# Altium schematic sheet IQ_Demodulator.SchDoc: =ProjectName
size 420 x 297 mm; Author: SBH; CompanyName: WUT; DrawnBy: SBH; Organization: ISE-WUT; Address1: Warsaw Univeristy of Technology; Address2: Nowowiejska 15/19; Revision: -; SheetNumber: -; SheetTotal: -; EDA_Number: ARTIQ; Projet: ADC/DAC MEZZANINE; ModifiedBy: -; CreateDate: XX/XX/XXXX; CheckedDate: -; Title2: IQ_Demodulator.SchDoc; DivGrp: ISE; Designer: SBH; ModifiedDate: -; ProjectName: ADC/DAC MEZZANINE
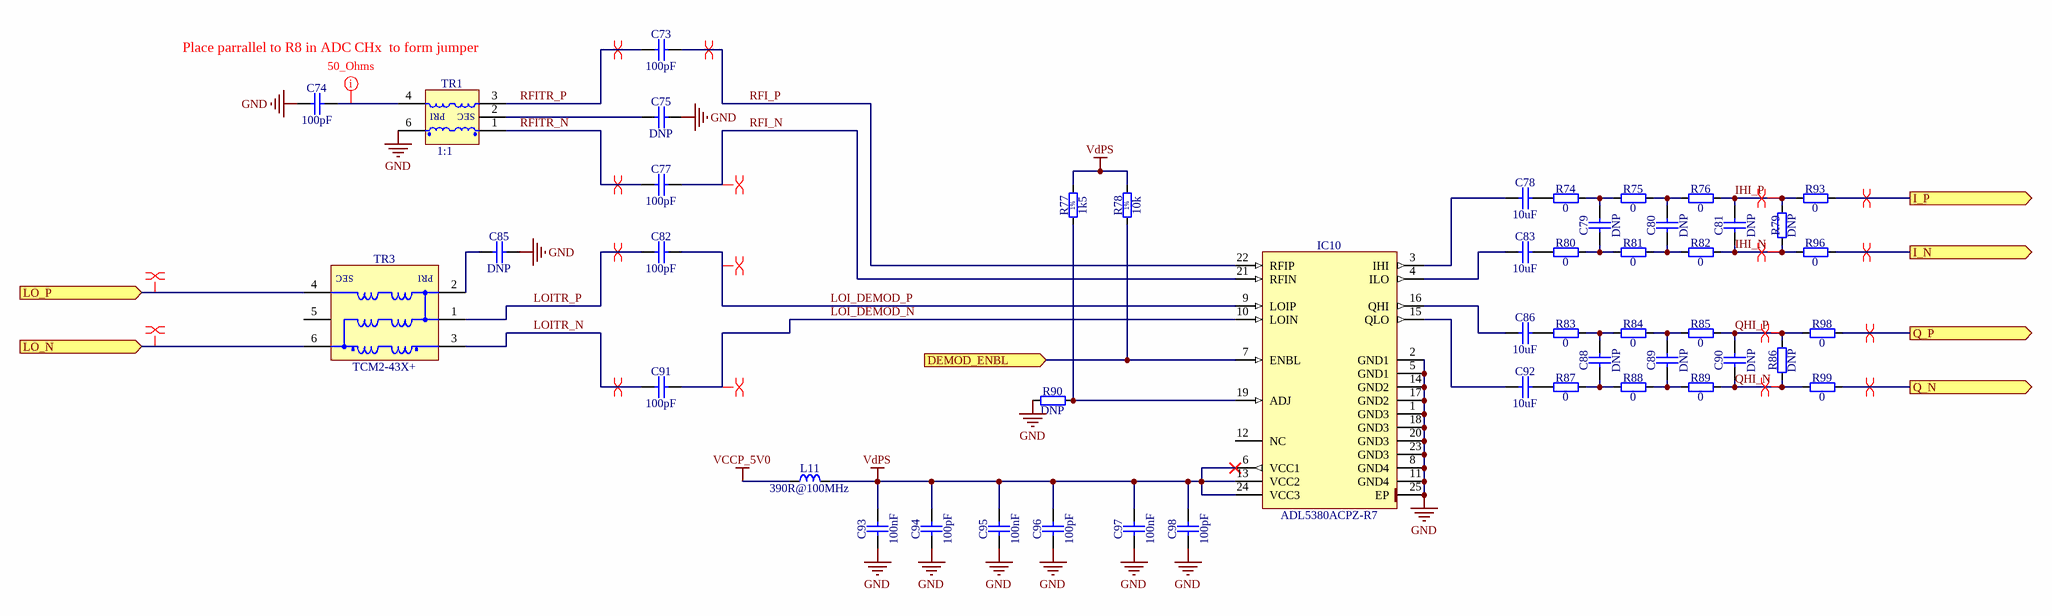
[diagram p0: IQ_Demodulator.SchDoc]

## Parts
C73  100pF  [CAPC1005X55N]
C74  100pF  [CAPC1005X55N]
C75  DNP  [CAPC1005X55N]
C77  100pF  [CAPC1005X55N]
C78  10uF  [CAPC1005X70N]
C79  DNP  [CAPC1005X55N]
C80  DNP  [CAPC1005X55N]
C81  DNP  [CAPC1005X55N]
C82  100pF  [CAPC1005X55N]
C83  10uF  [CAPC1005X70N]
C85  DNP  [CAPC1005X55N]
C86  10uF  [CAPC1005X70N]
C88  DNP  [CAPC1005X55N]
C89  DNP  [CAPC1005X55N]
C90  DNP  [CAPC1005X55N]
C91  100pF  [CAPC1005X55N]
C92  10uF  [CAPC1005X70N]
C93  100nF  [CAPC1005X55N]
C94  100pF  [CAPC1005X55N]
C95  100nF  [CAPC1005X55N]
C96  100pF  [CAPC1005X55N]
C97  100nF  [CAPC1005X55N]
C98  100pF  [CAPC1005X55N]
IC10  ADL5380ACPZ-R7  [QFN50P400X400X100-25N-S265]
L11  390R@100MHz  [INDC1608X95N]
R74  0  [RESC1005X40N]
R75  0  [RESC1005X40N]
R76  0  [RESC1005X40N]
R77  1k5  [RESC1005X40N]
R78  10k  [RESC1005X40N]
R79  DNP  [RESC1005X40N]
R80  0  [RESC1005X40N]
R81  0  [RESC1005X40N]
R82  0  [RESC1005X40N]
R83  0  [RESC1005X40N]
R84  0  [RESC1005X40N]
R85  0  [RESC1005X40N]
R86  DNP  [RESC1005X40N]
R87  0  [RESC1005X40N]
R88  0  [RESC1005X40N]
R89  0  [RESC1005X40N]
R90  DNP  [RESC1005X40N]
R93  0  [RESC1005X40N]
R96  0  [RESC1005X40N]
R98  0  [RESC1005X40N]
R99  0  [RESC1005X40N]
TR1  1:1  [XFMR_MINI-CIRCUITS_AT1521]
TR3  TCM2-43X+  [XFMR_MINI-CIRCUITS_DB1627]

## Ports
DEMOD_ENBL (in), I_N (out), I_P (out), LO_N (in), LO_P (in), Q_N (out), Q_P (out)

## Nets
GND: C74.1 C75.2 C85.2 C93.1 C94.1 C95.1 C96.1 C97.1 C98.1 IC10.1(GND3) IC10.2(GND1) IC10.5(GND1) IC10.8(GND4) IC10.11(GND4) IC10.14(GND2) IC10.17(GND2) IC10.18(GND3) IC10.20(GND3) IC10.23(GND3) IC10.25(EP) R90.1 TR1.6(PDOT)
VCCP_5V0: L11.1
VdPS: C93.2 C94.2 C95.2 C96.2 C97.2 C98.2 IC10.6(VCC1) IC10.13(VCC2) IC10.24(VCC3) L11.2 R77.2 R78.2
DEMOD_ENBL: IC10.7(ENBL) R78.1 ; port DEMOD_ENBL
I_N: R96.2 ; port I_N
I_P: R93.2 ; port I_P
IHI_N: C81.1 R79.1 R82.2 R96.1
IHI_P: C81.2 R76.2 R79.2 R93.1
LO_N: TR3.6(S1) ; port LO_N
LO_P: TR3.4(S1) ; port LO_P
LOI_DEMOD_N: C91.2 IC10.10(LOIN)
LOI_DEMOD_P: C82.2 IC10.9(LOIP)
LOITR_N: C91.1 TR3.3(P1)
LOITR_P: C82.1 TR3.1(P1)
Q_N: R99.2 ; port Q_N
Q_P: R98.2 ; port Q_P
QHI_N: C90.1 R86.1 R89.2 R99.1
QHI_P: C90.2 R85.2 R86.2 R98.1
RFI_N: C77.2 IC10.21(RFIN)
RFI_P: C73.2 IC10.22(RFIP)
RFITR_N: C77.1 TR1.1(SDOT)
RFITR_P: C73.1 TR1.3(S)
NetC74_2: C74.2 TR1.4(P)
NetC75_1: C75.1 TR1.2(NC)
NetC78_1: C78.1 IC10.3(IHI)
NetC78_2: C78.2 R74.1
NetC79_1: C79.1 R80.2 R81.1
NetC79_2: C79.2 R74.2 R75.1
NetC80_1: C80.1 R81.2 R82.1
NetC80_2: C80.2 R75.2 R76.1
NetC83_1: C83.1 IC10.4(ILO)
NetC83_2: C83.2 R80.1
NetC85_1: C85.1 TR3.2(P1)
NetC86_1: C86.1 IC10.16(QHI)
NetC86_2: C86.2 R83.1
NetC88_1: C88.1 R87.2 R88.1
NetC88_2: C88.2 R83.2 R84.1
NetC89_1: C89.1 R88.2 R89.1
NetC89_2: C89.2 R84.2 R85.1
NetC92_1: C92.1 IC10.15(QLO)
NetC92_2: C92.2 R87.1
NetIC10_19: IC10.19(ADJ) R77.1 R90.2

Not connected (* = marked no-connect by the designer): IC10 12(NC); TR3 5(NC)

## Layout directives
differential pair: I_N, I_P, IHI_N, IHI_P, LO_N, LO_P, LOI_DEMOD_N, LOI_DEMOD_P, LOITR_N, LOITR_P, Q_N, Q_P, QHI_N, QHI_P, RFI_N, RFI_P, RFITR_N, RFITR_P
net class 50_Ohms: NetC74_2

## Notes on the sheet
- Place parrallel to R8 in ADC CHx  to form jumper
- Project/Equipment
- Document
- Designer
- Drawn by
- Check.by
- File
- Last Mod.
- Print Date
- Sheet
- Size
- A3
- of
- Rev
- (in symbol R0402_1K5_1%_0.0625W_100PPM) 1%
- (in symbol R0402_10K_1%_0.0625W_100PPM) 1%
- (in symbol XFMR_MINI-CIRCUITS_TC1-1-43X+) PRI; SEC
- (in symbol XFMR_MINI-CIRCUITS_TCM2-43X+) SEC; PRI

## Library data of the parts
C73 C74 C77 C82 C91 C94 C96 C98 = CC0402_100PF_50V_5%_C0G: Non-polarised capacitor; Part Description: SMD Multilayer Chip Ceramic Capacitor; Manufacturer: GENERIC; Manufacturer1 Part Number: C0402C101J5GACTU; Voltage: 50V; TC: C0G/NP0; Tolerance: ±5%; Part Number: CC0402_100PF_50V_5%_C0G; Component Kind: Standard; Component Type: Standard; Pin Count: 2; Value: 100pF; Status: Preferred; Manufacturer Part Number: CC0402_100PF_50V_5%_C0G; Case: 0402; Mounted: Yes; Socket: No; SMD: Yes; Sense: No; Manufacturer1 Example: KEMET; Manufacturer1 ComponentHeight: 0.55mm; HelpURL: \\cern.ch\dfs\Applications\Altium\Datasheets\CC0805_C0G_KEMET_(Commercial Grade).pdf; Author: CERN DEM JLC; CreateDate: 2007-12-03; LatestRevisionDate: 2015-04-22
C75 C85 = CC0402_100PF_50V_5%_C0G: Non-polarised capacitor; Part Description: SMD Multilayer Chip Ceramic Capacitor; Manufacturer: GENERIC; Manufacturer1 Part Number: C0402C101J5GACTU; Value: 100pF; Voltage: 50V; TC: C0G/NP0; Tolerance: ±5%; Mounted: DNP; Part Number: CC0402_100PF_50V_5%_C0G; Component Kind: Standard; Component Type: Standard; Pin Count: 2; Status: Preferred; Manufacturer Part Number: CC0402_100PF_50V_5%_C0G; Case: 0402; Socket: No; SMD: Yes; Sense: No; Manufacturer1 Example: KEMET; Manufacturer1 ComponentHeight: 0.55mm; HelpURL: \\cern.ch\dfs\Applications\Altium\Datasheets\CC0805_C0G_KEMET_(Commercial Grade).pdf; Author: CERN DEM JLC; CreateDate: 2007-12-03; LatestRevisionDate: 2015-04-22
C78 C83 C86 C92 = CC0402_10UF_6.3V_20%_X5R: Non-polarised capacitor; Part Description: SMD Multilayer Chip Ceramic Capacitor; Manufacturer: GENERIC; Manufacturer1 Part Number: C1005X5R0J106M050BC; Voltage: 6.3V; TC: X5R; Tolerance: ±10%; Part Number: CC0402_10UF_6.3V_20%_X5R; Component Kind: Standard; Component Type: Standard; Pin Count: 2; Value: 10uF; Status: Preferred; Manufacturer Part Number: CC0402_10UF_6.3V_20%_X5R; Case: 0402; Mounted: Yes; Socket: No; SMD: Yes; Sense: No; Manufacturer1 Example: TDK; Manufacturer1 ComponentHeight: 0.70mm; HelpURL: \\cern.ch\dfs\Applications\Altium\Datasheets\CC0402_X5R_TDK_C.pdf; Author: CERN DEM JLC; CreateDate: 2015-01-07; LatestRevisionDate: 2015-01-07
C79-C81 C88-C90 = CC0402_1.5NF_50V_10%_X7R: Non-polarised capacitor; Part Description: SMD Multilayer Chip Ceramic Capacitor; Manufacturer: GENERIC; Manufacturer1 Part Number: 223858715625; Value: 1.5nF; Voltage: 50V; TC: X7R; Tolerance: ±10%; Mounted: DNP; Part Number: CC0402_1.5NF_50V_10%_X7R; Component Kind: Standard; Component Type: Standard; Pin Count: 2; Status: Not Recommended; Manufacturer Part Number: CC0402_1.5NF_50V_10%_X7R; Case: 0402; Socket: No; SMD: Yes; Sense: No; Manufacturer1 Example: PHYCOMP; Manufacturer1 ComponentHeight: 0.55mm; HelpURL: \\cern.ch\dfs\Applications\Altium\Datasheets\CC0402_X7R_PHYCOMP.pdf; Author: CERN DEM JLC; CreateDate: 2007-12-03; LatestRevisionDate: 2007-12-03
C93 C95 C97 = CC0402_100NF_16V_10%_X7R: Non-polarised capacitor; Part Description: SMD Multilayer Chip Ceramic Capacitor; Manufacturer: GENERIC; Manufacturer1 Part Number: GRM155R71C104KA88D; Voltage: 16V; TC: X7R; Tolerance: ±10%; Part Number: CC0402_100NF_16V_10%_X7R; Component Kind: Standard; Component Type: Standard; Pin Count: 2; Value: 100nF; Status: Not Recommended; Manufacturer Part Number: CC0402_100NF_16V_10%_X7R; Case: 0402; Mounted: Yes; Socket: No; SMD: Yes; Sense: No; Manufacturer1 Example: MURATA; Manufacturer1 ComponentHeight: 0.55mm; HelpURL: \\cern.ch\dfs\Applications\Altium\Datasheets\CC0402_X7R_MURATA_GRM.pdf; Author: CERN DEM JLC; CreateDate: 2013-12-05; LatestRevisionDate: 2007-12-03
IC10 = ADL5380ACPZ-R7: 400 MHz to 6 GHz Quadrature Demodulator; Manufacturer: ANALOG DEVICES; PressFit: No; Bonding: No; Part Number: ADL5380ACPZ-R7; Component Kind: Standard; Component Type: Standard; Device: ADL5380ACPZ-R7; PackageDescription: QFN,0.50mm pitch,square;6 pin X 6 pin,4.0mm X 4.0mm X 1.00mm H body (w/thermal tab 2.65 X 2.65mm),  IPC Medium Density; Part Description: 400 MHz to 6 GHz Quadrature Demodulator; Manufacturer Part Number: ADL5380ACPZ-R7; Pin Count: 25; Case: QFN24; Mounted: Yes; Socket: No; SMD: Yes; Sense: No; ComponentHeight: 1mm; Author: CERN DEM JLC; HelpURL: \\cern.ch\dfs\Applications\Altium\Datasheets\ADL5380ACPZ-R7.pdf; CreateDate: 2011-01-24; LatestRevisionDate: 2011-01-24
L11 = IND0603_TDK_MPZ1608R391A: Inductor; Part Description: SMT Chip Bead for Power Line; Manufacturer: TDK; Power: 1.2A; Resistance: 0.12R; Tolerance: ±25%; Part Number: IND0603_TDK_MPZ1608R391A; Component Kind: Standard; Component Type: Standard; Pin Count: 2; Value: 390R@100MHz; Status: None; Manufacturer Part Number: MPZ1608R391A; Case: 0603; Mounted: Yes; Socket: No; SMD: Yes; Sense: No; ComponentHeight: 0.95mm; HelpURL: \\cern.ch\dfs\Applications\Altium\Datasheets\IND0603_TDK_MPZ1608.pdf; Author: CERN DEM JLC; CreateDate: 2009-12-02; LatestRevisionDate: 2009-12-02
R74-R76 R80-R85 R87-R89 R93 R96 R98 R99 = R0402_0R_JUMPER: Resistor; Part Description: 1A (0.05R Max DC Resistance) Zero Ohm Jumper; Manufacturer: GENERIC; Manufacturer1 Part Number: 232270591001L; Part Number: R0402_0R_JUMPER; Component Kind: Standard; Component Type: Standard; Pin Count: 2; Value: 0; Status: Not recommended; Manufacturer Part Number: R0402_0R_JUMPER; Case: 0402; Mounted: Yes; Sense: No; Socket: No; SMD: Yes; Manufacturer1 Example: YAGEO PHYCOMP; Manufacturer1 ComponentHeight: 0.4mm; HelpURL: \\cern.ch\dfs\Applications\Altium\Datasheets\R0402_Phycomp_RC0402.pdf; Author: CERN DEM JLC; CreateDate: 2007-12-03; LatestRevisionDate: 2012-10-17
R77 = R0402_1K5_1%_0.0625W_100PPM: Resistor - 1%; Part Description: General Purpose Thick Film Chip Resistor; Manufacturer: GENERIC; Manufacturer1 Part Number: 232270671502L; TC: ±100ppm/°C; Part Number: R0402_1K5_1%_0.0625W_100PPM; Component Kind: Standard; Component Type: Standard; Pin Count: 2; Value: 1k5; Status: Not recommended; Power: 0.0625W; Tolerance: ±1%; Manufacturer Part Number: R0402_1K5_1%_0.0625W_100PPM; Case: 0402; Mounted: Yes; Sense: No; Socket: No; SMD: Yes; Manufacturer1 Example: YAGEO PHYCOMP; Manufacturer1 ComponentHeight: 0.4mm; HelpURL: \\cern.ch\dfs\Applications\Altium\Datasheets\R0402_Phycomp_RC0402.pdf; Author: CERN DEM JLC; CreateDate: 2007-12-03; LatestRevisionDate: 2012-10-17
R78 = R0402_10K_1%_0.0625W_100PPM: Resistor - 1%; Part Description: General Purpose Thick Film Chip Resistor; Manufacturer: GENERIC; Manufacturer1 Part Number: 232270671003L; TC: ±100ppm/°C; Part Number: R0402_10K_1%_0.0625W_100PPM; Component Kind: Standard; Component Type: Standard; Pin Count: 2; Value: 10k; Status: Not recommended; Power: 0.0625W; Tolerance: ±1%; Manufacturer Part Number: R0402_10K_1%_0.0625W_100PPM; Case: 0402; Mounted: Yes; Sense: No; Socket: No; SMD: Yes; Manufacturer1 Example: YAGEO PHYCOMP; Manufacturer1 ComponentHeight: 0.4mm; HelpURL: \\cern.ch\dfs\Applications\Altium\Datasheets\R0402_Phycomp_RC0402.pdf; Author: CERN DEM JLC; CreateDate: 2007-12-03; LatestRevisionDate: 2012-10-17
R79 R86 R90 = R0402_0R_JUMPER: Resistor; Part Description: 1A (0.05R Max DC Resistance) Zero Ohm Jumper; Manufacturer: GENERIC; Manufacturer1 Part Number: 232270591001L; Value: 0; Mounted: DNP; Part Number: R0402_0R_JUMPER; Component Kind: Standard; Component Type: Standard; Pin Count: 2; Status: Not recommended; Manufacturer Part Number: R0402_0R_JUMPER; Case: 0402; Sense: No; Socket: No; SMD: Yes; Manufacturer1 Example: YAGEO PHYCOMP; Manufacturer1 ComponentHeight: 0.4mm; HelpURL: \\cern.ch\dfs\Applications\Altium\Datasheets\R0402_Phycomp_RC0402.pdf; Author: CERN DEM JLC; CreateDate: 2007-12-03; LatestRevisionDate: 2012-10-17
TR1 = XFMR_MINI-CIRCUITS_TC1-1-43X+: 50 Ohms 650 To 4000MHz RF Transformer; Part Number: XFMR_MINI-CIRCUITS_TC1-1-43X+; Component Kind: Standard; Component Type: Standard; Pin Count: 5; Value: 1:1; Status: None; Part Description: 50 Ohms 650 To 4000MHz RF Transformer; Manufacturer: MINI-CIRCUITS; Manufacturer Part Number: TC1-1-43X+; Mounted: Yes; Socket: No; Sense: No; SMD: Yes; ComponentHeight: 4.06mm; HelpURL: \\cern.ch\dfs\Applications\Altium\Datasheets\XFMR_MINI-CIRCUITS_TC1-1-43X+.pdf; Author: CERN DEM JMW; CreateDate: 2016-08-10; LatestRevisionDate: 2016-08-10
TR3 = XFMR_MINI-CIRCUITS_TCM2-43X+: 50 OHMS 10 to 4000 MHz RF Transformer; Power: 0.4W; Part Number: XFMR_MINI-CIRCUITS_TCM2-43X+; Component Kind: Standard; Component Type: Standard; Pin Count: 6; Value: TCM2-43X+; Status: None; Part Description: 50 Ohms 10 to 4000MHz RF Transformer; Manufacturer: MINI-CIRCUITS; Manufacturer Part Number: TCM2-43X+; Mounted: Yes; Socket: No; Sense: No; SMD: Yes; ComponentHeight: 4.06mm; HelpURL: \\cern.ch\dfs\Applications\Altium\Datasheets\XFMR_MINI-CIRCUITS_TCM2-43X+.pdf; Author: CERN DEM BC; CreateDate: 2016-02-12; LatestRevisionDate: 2016-02-12